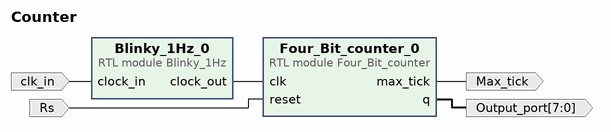
[diagram p0: block diagram of the top level]
# Vivado block design Counter, Vivado 2016.2
create_bd_design Counter

create_bd_port -dir I clk_in
create_bd_port -dir I Rs
create_bd_port -dir O Max_tick
create_bd_port -dir O -from 7 -to 0 Output_port

create_bd_cell -type module -reference Four_Bit_counter Four_Bit_counter_0
create_bd_cell -type module -reference Blinky_1Hz Blinky_1Hz_0

# ---- connections ----

connect_bd_net [get_bd_pins Blinky_1Hz_0/clock_out] [get_bd_pins Four_Bit_counter_0/clk]
connect_bd_net [get_bd_ports clk_in] [get_bd_pins Blinky_1Hz_0/clock_in]
connect_bd_net [get_bd_ports Rs] [get_bd_pins Four_Bit_counter_0/reset]
connect_bd_net [get_bd_pins Four_Bit_counter_0/max_tick] [get_bd_ports Max_tick]
connect_bd_net [get_bd_pins Four_Bit_counter_0/q] [get_bd_ports Output_port]

validate_bd_design
save_bd_design
